# EasyEDA Pro project ProPrj_电容计量V2_2026-06-24.epro, schematic Schematic15_2
Board Name: Board1; Create Date: 2026-01-06; Page Name: P1; Project Name: 电容计量1; Schematic Name: Schematic5; Update Date: 2026-01-06; Page Size: A4; Version: V1.0
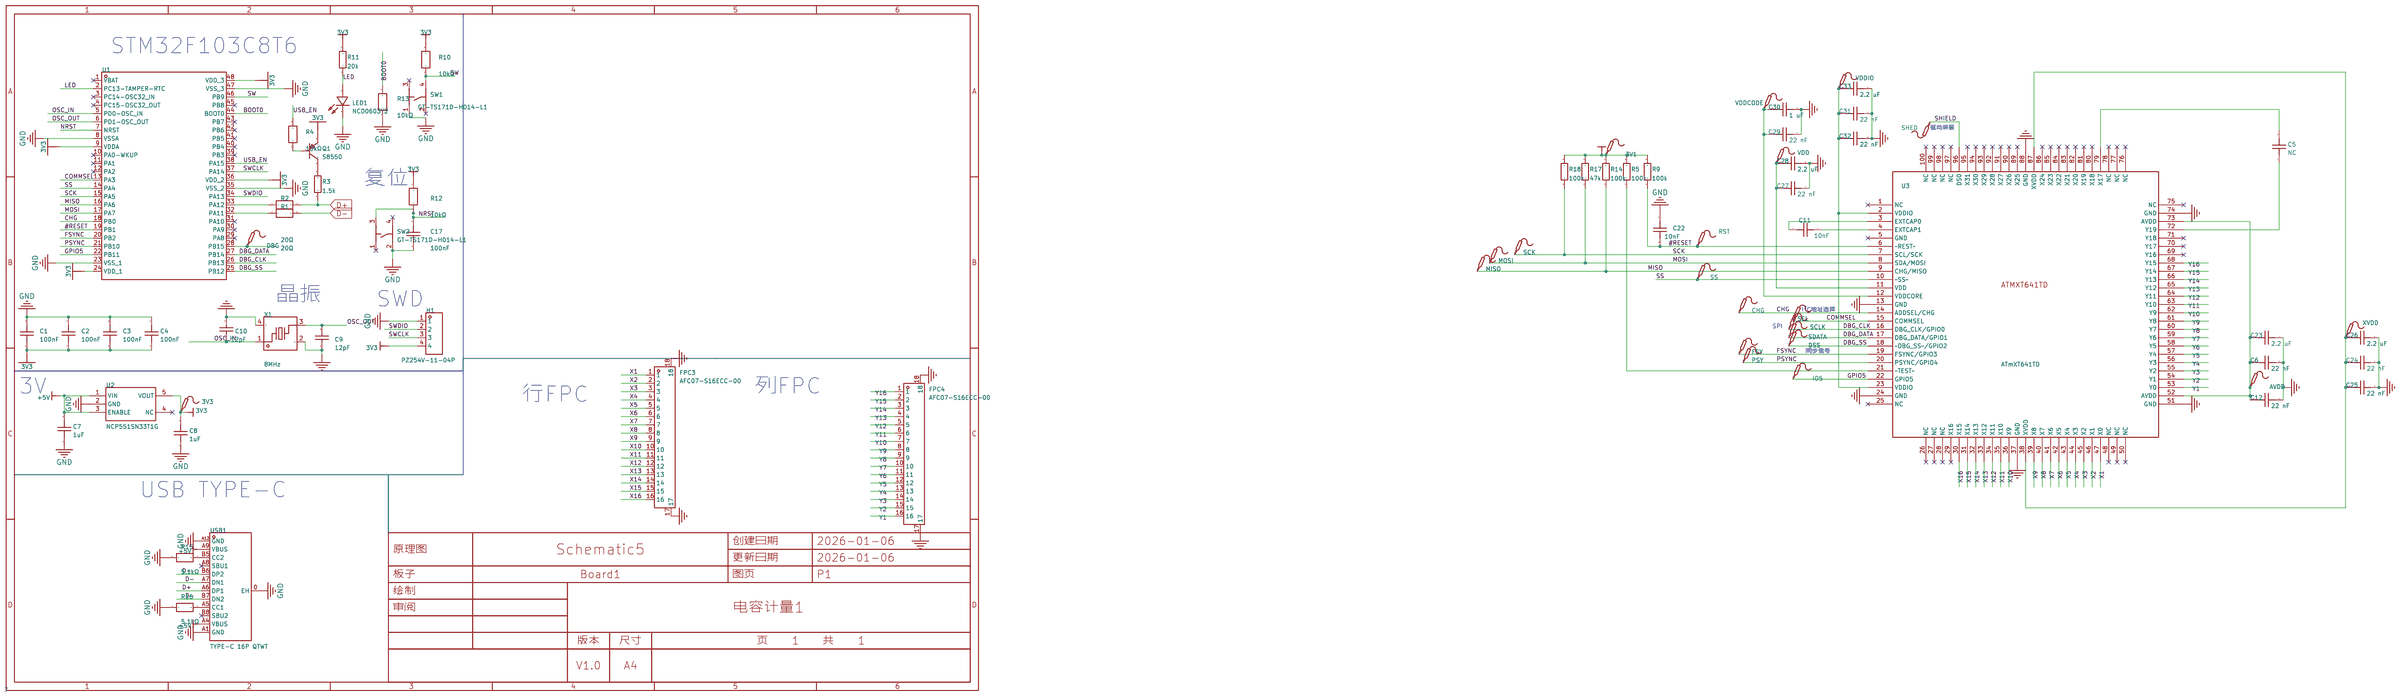
[diagram p7: schematic sheet]

## Parts
3V1  -  [Test-Point-0.5mm]
3V3  -  [Test-Point-0.5mm]
AVDD  -  [Test-Point-0.5mm]
C1  100nF  [C0402]
C2  100nF  [C0402]
C3  100nF  [C0402]
C4  100nF  [C0402]
C5  NC  [C0402]
C6  22 nF  [C0402]
C7  1uF  [C0402]
C8  1uF  [C0402]
C9  12pF  [C0402]
C10  12pF  [C0402]
C11  10nF  [C0402]
C12  22 nF  [C0402]
C17  100nF  [C0402]
C22  10nF  [C0402]
C23  2.2 uF  [C0402]
C24  22 nF  [C0402]
C25  22 nF  [C0402]
C26  2.2 uF  [C0402]
C27  22 nF  [C0402]
C28  2.2 uF  [C0402]
C29  22 nF  [C0402]
C30  1 uF  [C0402]
C31  22 nF  [C0402]
C32  22 nF  [C0402]
C33  2.2 uF  [C0402]
CHG  -  [Test-Point-0.5mm]
DBG  -  [Test-Point-0.5mm]
DSS  -  [Test-Point-0.5mm]
FPC3  AFC07-S16ECC-00  [FPC-SMD_16P-P0.50_AFC07-S16ECC-00]
FPC4  AFC07-S16ECC-00  [FPC-SMD_16P-P0.50_AFC07-S16ECC-00]
FSY  -  [Test-Point-0.5mm]
H1  PZ254V-11-04P  [HDR-TH_4P-P2.54-V-M]
IO5  -  [Test-Point-0.5mm]
LED1  NCD0603Y2  [LED0603-RD]
MISO  -  [Test-Point-0.5mm]
MOSI  -  [Test-Point-0.5mm]
PSY  -  [Test-Point-0.5mm]
Q1  S8550  [SOT-23-3_L2.9-W1.3-P1.90-LS2.4-BR]
R1  20Ω  [R0402]
R2  20Ω  [R0402]
R3  1.5k  [R0402]
R4  10kΩ  [R0402]
R5  100k  [R0402]
R9  100k  [R0402]
R10  10kΩ  [R0402]
R11  20k  [R0402]
R12  10kΩ  [R0402]
R13  10kΩ  [R0402]
R14  100k  [R0402]
R15  5.1kΩ  [R0402]
R16  5.1kΩ  [R0402]
R17  47k  [R0402]
R18  100k  [R0402]
RST  -  [Test-Point-0.5mm]
SCK  -  [Test-Point-0.5mm]
SCLK  -  [Test-Point-0.5mm]
SDATA  -  [Test-Point-0.5mm]
SEL  -  [Test-Point-0.5mm]
SHED  -  [Test-Point-0.5mm]
SS  -  [Test-Point-0.5mm]
SW1  GT-TS171D-H014-L1  [SW-SMD_4P-L3.0-W2.8-P1.65-TL_GT-TS171A-H014-L1]
SW2  GT-TS171D-H014-L1  [SW-SMD_4P-L3.0-W2.8-P1.65-TL_GT-TS171A-H014-L1]
U1  -  [LQFP-48_L7.0-W7.0-P0.50-LS9.0-BL]
U2  NCP551SN33T1G  [SOT-23-5_L3.0-W1.7-P0.95-LS2.8-BR]
U3  ATmXT641TD  [ATMXT641TD]
USB1  TYPE-C 16P QTWT  [USB-TYPE-C-SMD_TYPE-C-16P-QTWT]
VDD  -  [Test-Point-0.5mm]
VDDCODE  -  [Test-Point-0.5mm]
VDDIO  -  [Test-Point-0.5mm]
X1  8MHz  [CRYSTAL-SMD_4P-L3.2-W2.5-BL-1]
XVDD  -  [Test-Point-0.5mm]

## Library data of the parts
3V1 AVDD DBG VDD VDDCODE VDDIO XVDD = Test-Point: Test Point 测试点
3V3 CHG DSS FSY IO5 MISO MOSI PSY RST SCK SCLK SDATA SEL SHED SS = Test-Point: Test Point 测试点; Check: false
C1-C8 C11 C12 C22-C33 = CC0402KRX7R7BB104: 容值:100nF;精度:±10%;额定电压:16V;温度系数:X7R;; LCSC Part Name: 100nF ±10% 16V; Supplier Part: C60474; Manufacturer: YAGEO(国巨); Supplier Footprint: 0402; JLCPCB Part Class: Extended Part; Datasheet: https://atta.szlcsc.com/upload/public/pdf/source/20211223/9278FD768280B81DDBEF48FA36411A03.pdf; Supplier: LCSC; Tolerance: ±10%; Voltage Rated: 16V; Temperature Coefficient: X7R
C9 C10 = GCM1555C1H120FA16D: 容值:12pF;精度:±1%;额定电压:50V;材质(温度系数):C0G;; LCSC Part Name: 12pF ±1% 50V; Supplier Part: C393682; Manufacturer: muRata(村田); Supplier Footprint: 0402; JLCPCB Part Class: Extended Part; Datasheet: https://atta.szlcsc.com/upload/public/pdf/source/20190516/C393682_2405B7553F1D74F0F214F12B2CF6E34B.pdf; Supplier: LCSC; Tolerance: ±1%; Voltage Rated: 50V; Temperature Coefficient: C0G
C17 = CGA0402X7R104K160GT: 容值:100nF;精度:±10%;额定电压:16V;温度系数:X7R;; LCSC Part Name: 100nF ±10% 16V; Supplier Part: C6119799; Manufacturer: HRE(芯声); Supplier Footprint: 0402; JLCPCB Part Class: Extended Part; Datasheet: https://item.szlcsc.com/datasheet/CGA0402X7R104K160GT/7062505.html; Supplier: LCSC; Tolerance: ±10%; Voltage Rating: 16V; Temperature Coefficient: X7R
FPC3 FPC4 = AFC07-S16ECC-00: 锁定特性:抽屉式;触点类型:上接;触点数量:16P;间距:0.5mm;安装方式:卧贴;工作温度:-25℃~+85℃;; LCSC Part Name: 抽屉式 上接 P数:16P 间距:0.5mm; Supplier Part: C11088; Manufacturer: JS(钜硕电子); Supplier Footprint: SMD,P=0.5mm,卧贴; JLCPCB Part Class: Extended Part; Datasheet: https://item.szlcsc.com/datasheet/AFC07-S16ECC-00/11635.html; Supplier: LCSC; Locking Feature: 抽屉式; Contact Type: 上接; Number of Contacts: 16P; Pitch: 0.5mm; Mounting Type: 卧贴; FFC, FCB Thickness: 0.3mm; Height Above Board: 2mm; Contact Material: 磷青铜; Contact Plating: 锡; Operating Temperature: -25℃~+85℃; Rated Voltage (Max): 50V; Current Rating (Max): 400mA
H1 = PZ254V-11-04P: 插针结构:1x4P;间距:2.54mm;行距:-;圆针/方针:方针;安装方式:直插;排数:单排;总PIN位数:4P;额定电流:3A;额定电压:250V;配合针长度:6mm;塑高:2.5mm;端接针长度:3mm;触头材质:-;工作温度:-40℃~+105℃;颜色:黑色;; LCSC Part Name: 1x4P 间距:2.54mm 方针 直插; Supplier Part: C2691448; Manufacturer: XFCN(兴飞); Supplier Footprint: 插件,P=2.54mm; JLCPCB Part Class: 扩展库; Datasheet: https://item.szlcsc.com/datasheet/PZ254V-11-04P/2801085.html; Supplier: LCSC; Pin Structure: 1x4P; Pitch: 2.54mm; Circluar Pins/Square Pins: 方针; Mounting Type: 直插; Number of Rows: 单排; Number of Pins: 4P; Current Rating: 3A; Voltage Rating (Max): 250V; Length of Mating Pin: 6mm; Insulation Height: 2.5mm; Length of End Connection Pin: 3mm; Operating Temperature: -40℃~+105℃; Color: 黑色
LED1 = NCD0603Y2: 发光颜色:黄色;正向电压(VF):1.6V~2.6V;功率:65mW;正向电流:20mA;主波长:586nm~595nm;透镜颜色:无色透明透镜;发光强度:100mcd~220mcd;发光角度:130°;工作温度:-30℃~+85℃;; Supplier Part: C89811; Manufacturer: 国星光电; Supplier Footprint: 0603; JLCPCB Part Class: Extended Part; Datasheet: https://atta.szlcsc.com/upload/public/pdf/source/20200820/C89811_7FE84B429B6BCA3E113B125EE1452576.pdf; Supplier: LCSC; Emitted Color: 黄色; Forward Voltage (VF): 1.6V~2.6V; Power Dissipation: 65mW; Forward Current: 20mA; Dominant Wavelength: 586nm~595nm; Lens Color: 无色透明透镜; Luminous Intensity: 100mcd~220mcd; Viewing Angle: 130°; Operating Temperature: -30℃~+85℃
Q1 = S8550: LCSC Part Name: PNP -25V -500mA 120-400 SOT-23; Supplier Part: C2931720; Manufacturer: Doeshare(德芯); Supplier Footprint: SOT-23; JLCPCB Part Class: 扩展库; Datasheet: https://atta.szlcsc.com/upload/public/pdf/source/20220104/15A23F6542E365B9E2BA018BE45092B6.pdf; Supplier: LCSC
R1 R2 = CR0402J20R0Q10Z: 电阻类型:厚膜电阻;阻值:20Ω;精度:±5%;功率:63mW;温度系数:±100ppm/℃;; LCSC Part Name: 厚膜电阻 20Ω ±5% 63mW; Supplier Part: C881226; Manufacturer: EVER OHMS(天二科技); Supplier Footprint: 0402; JLCPCB Part Class: Extended Part; Datasheet: https://atta.szlcsc.com/upload/public/pdf/source/20201014/C881429_ABC29D63C8D6A11EB63D87348B25AA7B.pdf; Supplier: LCSC; Type: 厚膜电阻; Tolerance: ±5%; Power(Watts): 63mW; Temperature Coefficient: ±100ppm/℃; Operating Temperature Range: -55℃~+155℃
R3 R5 R9 R11 R14 R17 R18 = 0603WAF1002T5E: LCSC Part Name: 10KΩ(1002) ±1% 编带; Supplier Part: C25804; Manufacturer: UNI-ROYAL(厚声); Supplier Footprint: 0603; JLCPCB Part Class: Basic Part; Datasheet: https://atta.szlcsc.com/upload/public/pdf/source/20170920/C25804_1505901551523983377.pdf; Supplier: LCSC
R4 R10 R12 R13 = RCA0210KJLF: 阻值:10kΩ;精度:±5%;功率:62.5mW;; LCSC Part Name: 10kΩ ±5% 62.5mW; Supplier Part: C22356213; Manufacturer: HKR(香港电阻); Supplier Footprint: 0402; JLCPCB Part Class: Extended Part; Datasheet: https://atta.szlcsc.com/upload/public/pdf/source/20240312/EB29F8B3E9AD4CE07E65E9956C47F4F5.pdf; Supplier: LCSC; Tolerance: ±5%; Power(Watts): 62.5mW
R15 R16 = RCA025K1JLF: 电阻类型:厚膜电阻;阻值:5.1kΩ;精度:±5%;功率:62.5mW;工作电压:50V;温度系数:±200ppm/℃;; LCSC Part Name: 5.1kΩ ±5% 62.5mW; Supplier Part: C22356228; Manufacturer: HKR(香港电阻); Supplier Footprint: 0402; JLCPCB Part Class: Extended Part; Datasheet: https://item.szlcsc.com/datasheet/RCA025K1JLF/23789672.html; Supplier: LCSC; Type: 厚膜电阻; Tolerance: ±5%; Power(Watts): 62.5mW; Voltage-Supply(Max): 50V; Temperature Coefficient: ±200ppm/℃; Operating Temperature: -55℃~+155℃
SW1 SW2 = GT-TS171D-H014-L1: 电路结构:单刀单掷;按钮形状:圆形按钮;作用力:80gf;安装方式:立贴;开关长度:3mm;开关宽度:2.75mm;开关高度:1.4mm;带支架:不带支架;触点电流:50mA;额定电压:12V;带灯:无;工作寿命:10万次;; LCSC Part Name: 3*2.75*1.4mm 立贴 轻触开关; Supplier Part: C2762969; Manufacturer: G-Switch(品赞); Supplier Footprint: SMD; JLCPCB Part Class: Extended Part; Datasheet: https://item.szlcsc.com/datasheet/GT-TS171D-H014-L1/2892001.html; Supplier: LCSC; Circuit: 单刀单掷; Actuator Style: 圆形按钮; Operating Force: 80gf; Mounting Type: 立贴; Length: 3mm; Width: 2.75mm; Switch Height: 1.4mm; with Bracket: 不带支架; Contact Current: 50mA; Voltage Rating: 12V; Actuator/Cap Color: 白色; With Lamp: 无; Termination Style: SMD接片; Life: 10万次; Operating Temperature: -30℃~+85℃
U1 = STM32F103C8T6: 工作电压:2V ~ 3.6V;CPU位数:32-Bit;CPU内核:ARM- Cortex--M3;主频（MAX):72MHz;ROM类型:FLASH;; Supplier Part: C8734; Manufacturer: ST(意法半导体); Supplier Footprint: LQFP-48_7x7x05P; JLCPCB Part Class: Basic Part; Datasheet: https://atta.szlcsc.com/upload/public/pdf/source/20140724/1457707174202.pdf; Supplier: LCSC
U2 = NCP551SN33T1G: 输出类型:固定;最大输入电压:12V;输出电压:3.3V;最大输出电流:150mA;电源纹波抑制比(PSRR):-;输出极性:正极;; LCSC Part Name: 输入12V 输出3.3V 150mA; Supplier Part: C58434; Manufacturer: onsemi(安森美); Supplier Footprint: TSOP-5; JLCPCB Part Class: 扩展库; Datasheet: https://atta.szlcsc.com/upload/public/pdf/source/20150917/1457707389016.pdf; Supplier: LCSC; Output Type: 固定; Maximum Input Voltage: 12V; Output Voltage: 3.3V; MAX Output Current: 150mA; Dropout Voltage: 150mV@(10mA); standby current: 8uA; Operating Temperature: -40℃~+85℃; Output Polarity: 正极; Number of Outputs: 1
U3 = ATmXT641TD
USB1 = TYPE-C 16P QTWT: 连接器类型:Type-C;协议标准:USB 3.1;公母:母;安装方式:卧贴;触点数量:16P;端口数量:1;额定电流 - 电源:3A;工作温度:-25℃~+85℃;; LCSC Part Name: Type-C 母 卧贴; Supplier Part: C5187472; Manufacturer: SHOU HAN(首韩); Supplier Footprint: SMD; JLCPCB Part Class: Extended Part; Datasheet: https://item.szlcsc.com/datasheet/TYPE-C%252016P%2520QTWT/5860367.html; Supplier: LCSC; Connector Type: Type-C; Protocol Standard: USB 3.1; Gender: 母; Mounting Type: 卧贴; Number of Contacts: 16P; Number of Ports: 1; Current Rating-Power: 3A; Voltage Rating: 5V; Connect-Disconnect Life: 5千次; Detection color: 黑色; Operating Temperature: -25℃~+85℃
X1 = XL2EL89COI-111YLC-8M: 晶振类型:贴片晶振;频率:8MHz;常温频差:±10ppm;外接负载电容:12pF;频率稳定度(全温):±20ppm;; LCSC Part Name: 8MHz ±10ppm 12pF; Supplier Part: C2973805; Manufacturer: YXC(扬兴晶振); Supplier Footprint: SMD3225-4P; JLCPCB Part Class: 扩展库; Datasheet: https://atta.szlcsc.com/upload/public/pdf/source/20240329/19D5F850207469550BEB00D7DFEDBC7A.pdf; Supplier: LCSC; Crystal Type: 贴片晶振; Normal temperature Frequency Tolerance: ±10ppm; External load capacitor: 12pF; Frequency Stability(Full temperature range): ±20ppm; Equivalent Series Resistance (ESR): 150Ω; Operating Temperature: -40℃~+85℃

## Nets
3V3: 3V1.1 3V3.1 C1.1 C2.1 C3.1 C4.1 C8.2 H1.4 Q1.2(E) R5.2 R9.2 R10.2 R11.2 R12.2 R14.2 R17.2 R18.2 U1.9(VDDA) U1.24(VDD_1) U1.36(VDD_2) U1.48(VDD_3) U2.5(VOUT)
+5V: C7.2 U2.1(VIN) U2.3(ENABLE) USB1.A4(VBUS) USB1.A9(VBUS)
GND: C1.2 C2.2 C3.2 C4.2 C6.1 C7.1 C8.1 C9.1 C10.2 C12.1 C17.1 C22.1 C23.1 C24.1 C25.1 C26.1 C27.1 C28.1 C29.1 C30.1 C31.1 C32.1 C33.1 FPC3.17 FPC3.18 FPC4.17 FPC4.18 H1.1 LED1.1(K) R13.1 R15.2 R16.2 SW1.1 SW2.2 U1.8(VSSA) U1.23(VSS_1) U1.35(VSS_2) U1.47(VSS_3) U2.2(GND) U3.13(GND) U3.24(GND) U3.37(GND) U3.51(GND) U3.74(GND) U3.88(GND) USB1.0(EH) USB1.A1(GND) USB1.A12(GND) X1.2(GND) X1.4(GND)
#RESET: C22.2 R9.1 RST.1 U1.19(PB1) U3.6(~REST~)
BOOT0: R13.2 U1.44(BOOT0)
CHG: CHG.1 U1.18(PB0) U3.14(ADDSEL/CHG)
COMMSEL: SEL.1 U1.13(PA3) U3.15(COMMSEL)
D+: R2.2 R3.1 USB1.A6(DP1) USB1.B6(DP2)
D-: R1.2 USB1.A7(DN1) USB1.B7(DN2)
DBG_CLK: SCLK.1 U1.26(PB13) U3.16(DBG_CLK/GPIO0)
DBG_DATA: SDATA.1 U1.27(PB14) U3.17(DBG_DATA/GPIO1)
DBG_SS: DSS.1 U1.25(PB12) U3.18(~DBG_SS~/GPIO2)
FSYNC: FSY.1 U1.20(PB2) U3.19(FSYNC/GPIO3)
GPIO5: IO5.1 U1.22(PB11) U3.22(GPIO5)
LED: LED1.2(A) R11.1 U1.2(PC13-TAMPER-RTC)
MISO: MISO.1 R14.1 U1.16(PA6) U3.9(CHG/MISO)
MOSI: MOSI.1 R17.1 U1.17(PA7) U3.8(SDA/MOSI)
NRST: C17.2 R12.1 SW2.3 U1.7(NRST)
OSC_IN: C10.1 U1.5(PD0-OSC_IN) X1.1
OSC_OUT: C9.2 U1.6(PD1-OSC_OUT) X1.3
PSYNC: PSY.1 U1.21(PB10) U3.20(PSYNC/GPIO4)
SCK: R18.1 SCK.1 U1.15(PA5) U3.7(SCL/SCK)
SHIELD: SHED.1 U3.96(DS0)
SS: SS.1 U1.14(PA4) U3.10(~SS~)
SW: R10.1 SW1.4 U1.46(PB9)
SWCLK: H1.3 U1.37(PA14)
SWDIO: H1.2 U1.34(PA13)
USB_EN: R4.2 U1.38(PA15)
X1: FPC3.1 U3.47(X0)
X2: FPC3.2 U3.46(X1)
X3: FPC3.3 U3.45(X2)
X4: FPC3.4 U3.44(X3)
X5: FPC3.5 U3.43(X4)
X6: FPC3.6 U3.42(X5)
X7: FPC3.7 U3.41(X6)
X8: FPC3.8 U3.40(X7)
X9: FPC3.9 U3.39(X8)
X10: FPC3.10 U3.36(X9)
X11: FPC3.11 U3.35(X10)
X12: FPC3.12 U3.34(X11)
X13: FPC3.13 U3.33(X12)
X14: FPC3.14 U3.32(X13)
X15: FPC3.15 U3.31(X14)
X16: FPC3.16 U3.30(X15)
Y1: FPC4.16 U3.53(Y0)
Y2: FPC4.15 U3.54(Y1)
Y3: FPC4.14 U3.55(Y2)
Y4: FPC4.13 U3.56(Y3)
Y5: FPC4.12 U3.57(Y4)
Y6: FPC4.11 U3.58(Y5)
Y7: FPC4.10 U3.59(Y6)
Y8: FPC4.9 U3.60(Y7)
Y9: FPC4.8 U3.61(Y8)
Y10: FPC4.7 U3.62(Y9)
Y11: FPC4.6 U3.63(Y10)
Y12: FPC4.5 U3.64(Y11)
Y13: FPC4.4 U3.65(Y12)
Y14: FPC4.3 U3.66(Y13)
Y15: FPC4.2 U3.67(Y14)
Y16: FPC4.1 U3.68(Y15)
$1N12: R16.1 USB1.A5(CC1)
$1N14: R15.1 USB1.B5(CC2)
$1N67: DBG.1 U1.28(PB15)
$1N194: Q1.1(B) R4.1
$1N196: Q1.3(C) R3.2
$1N212: R2.1 U1.33(PA12)
$1N232: R1.1 U1.32(PA11)
$1N278: C11.2 U3.3(EXTCAP0)
$1N299: R5.1 U3.21(~TEST~)
$1N380: C5.2 U3.79(X17)
$1N516: C5.1 U3.72(Y19)
$1N517: C11.1 U3.4(EXTCAP1)
$1N533: AVDD.1 C6.2 C12.2 C23.2 U3.52(AVDD) U3.73(AVDD)
$1N537: C24.2 C25.2 C26.2 U3.38(XVDD) U3.87(XVDD) XVDD.1
$1N539: C27.2 C28.2 U3.11(VDD) VDD.1
$1N541: C29.2 C30.2 U3.12(VDDCORE) VDDCODE.1
$1N542: C31.2 C32.2 C33.2 U3.2(VDDIO) U3.23(VDDIO) VDDIO.1

Not connected (* = marked no-connect by the designer): SW1 2* 3*; SW2 1* 4*; U1 1(VBAT)* 3(PC14-OSC32_IN)* 4(PC15-OSC32_OUT)* 10(PA0-WKUP)* 11(PA1)* 12(PA2)* 29(PA8)* 30(PA9)* 31(PA10)* 39(PB3)* 40(PB4)* 41(PB5)* 42(PB6)* 43(PB7)* 45(PB8)*; U2 4(NC)*; U3 1(NC)* 5(GND)* 25(NC)* 26(NC)* 27(NC)* 28(NC)* 29(X16)* 48(NC)* 49(NC)* 50(NC)* 69(Y16)* 70(Y17)* 71(Y18)* 75(NC)* 76(NC)* 77(NC)* 78(NC)* 80(X18)* 81(X19)* 82(X20)* 83(X21)* 84(X22)* 85(X23)* 86(X24)* 89(X25)* 90(X26)* 91(X27)* 92(X28)* 93(X29)* 94(X30)* 95(X31)* 97(NC)* 98(NC)* 99(NC)* 100(NC)*; USB1 A8(SBU1)* B8(SBU2)*

## Notes on the sheet
- STM32F103C8T6
- 驱动屏蔽
- 复位
- 晶振
- SWD
- I²C地址选择
- SPI
- 同步信号
- 3V
- 列FPC
- 行FPC
- USB TYPE-C
